# Altium project beovox-poe.PrjPcb (part 1 of 2)
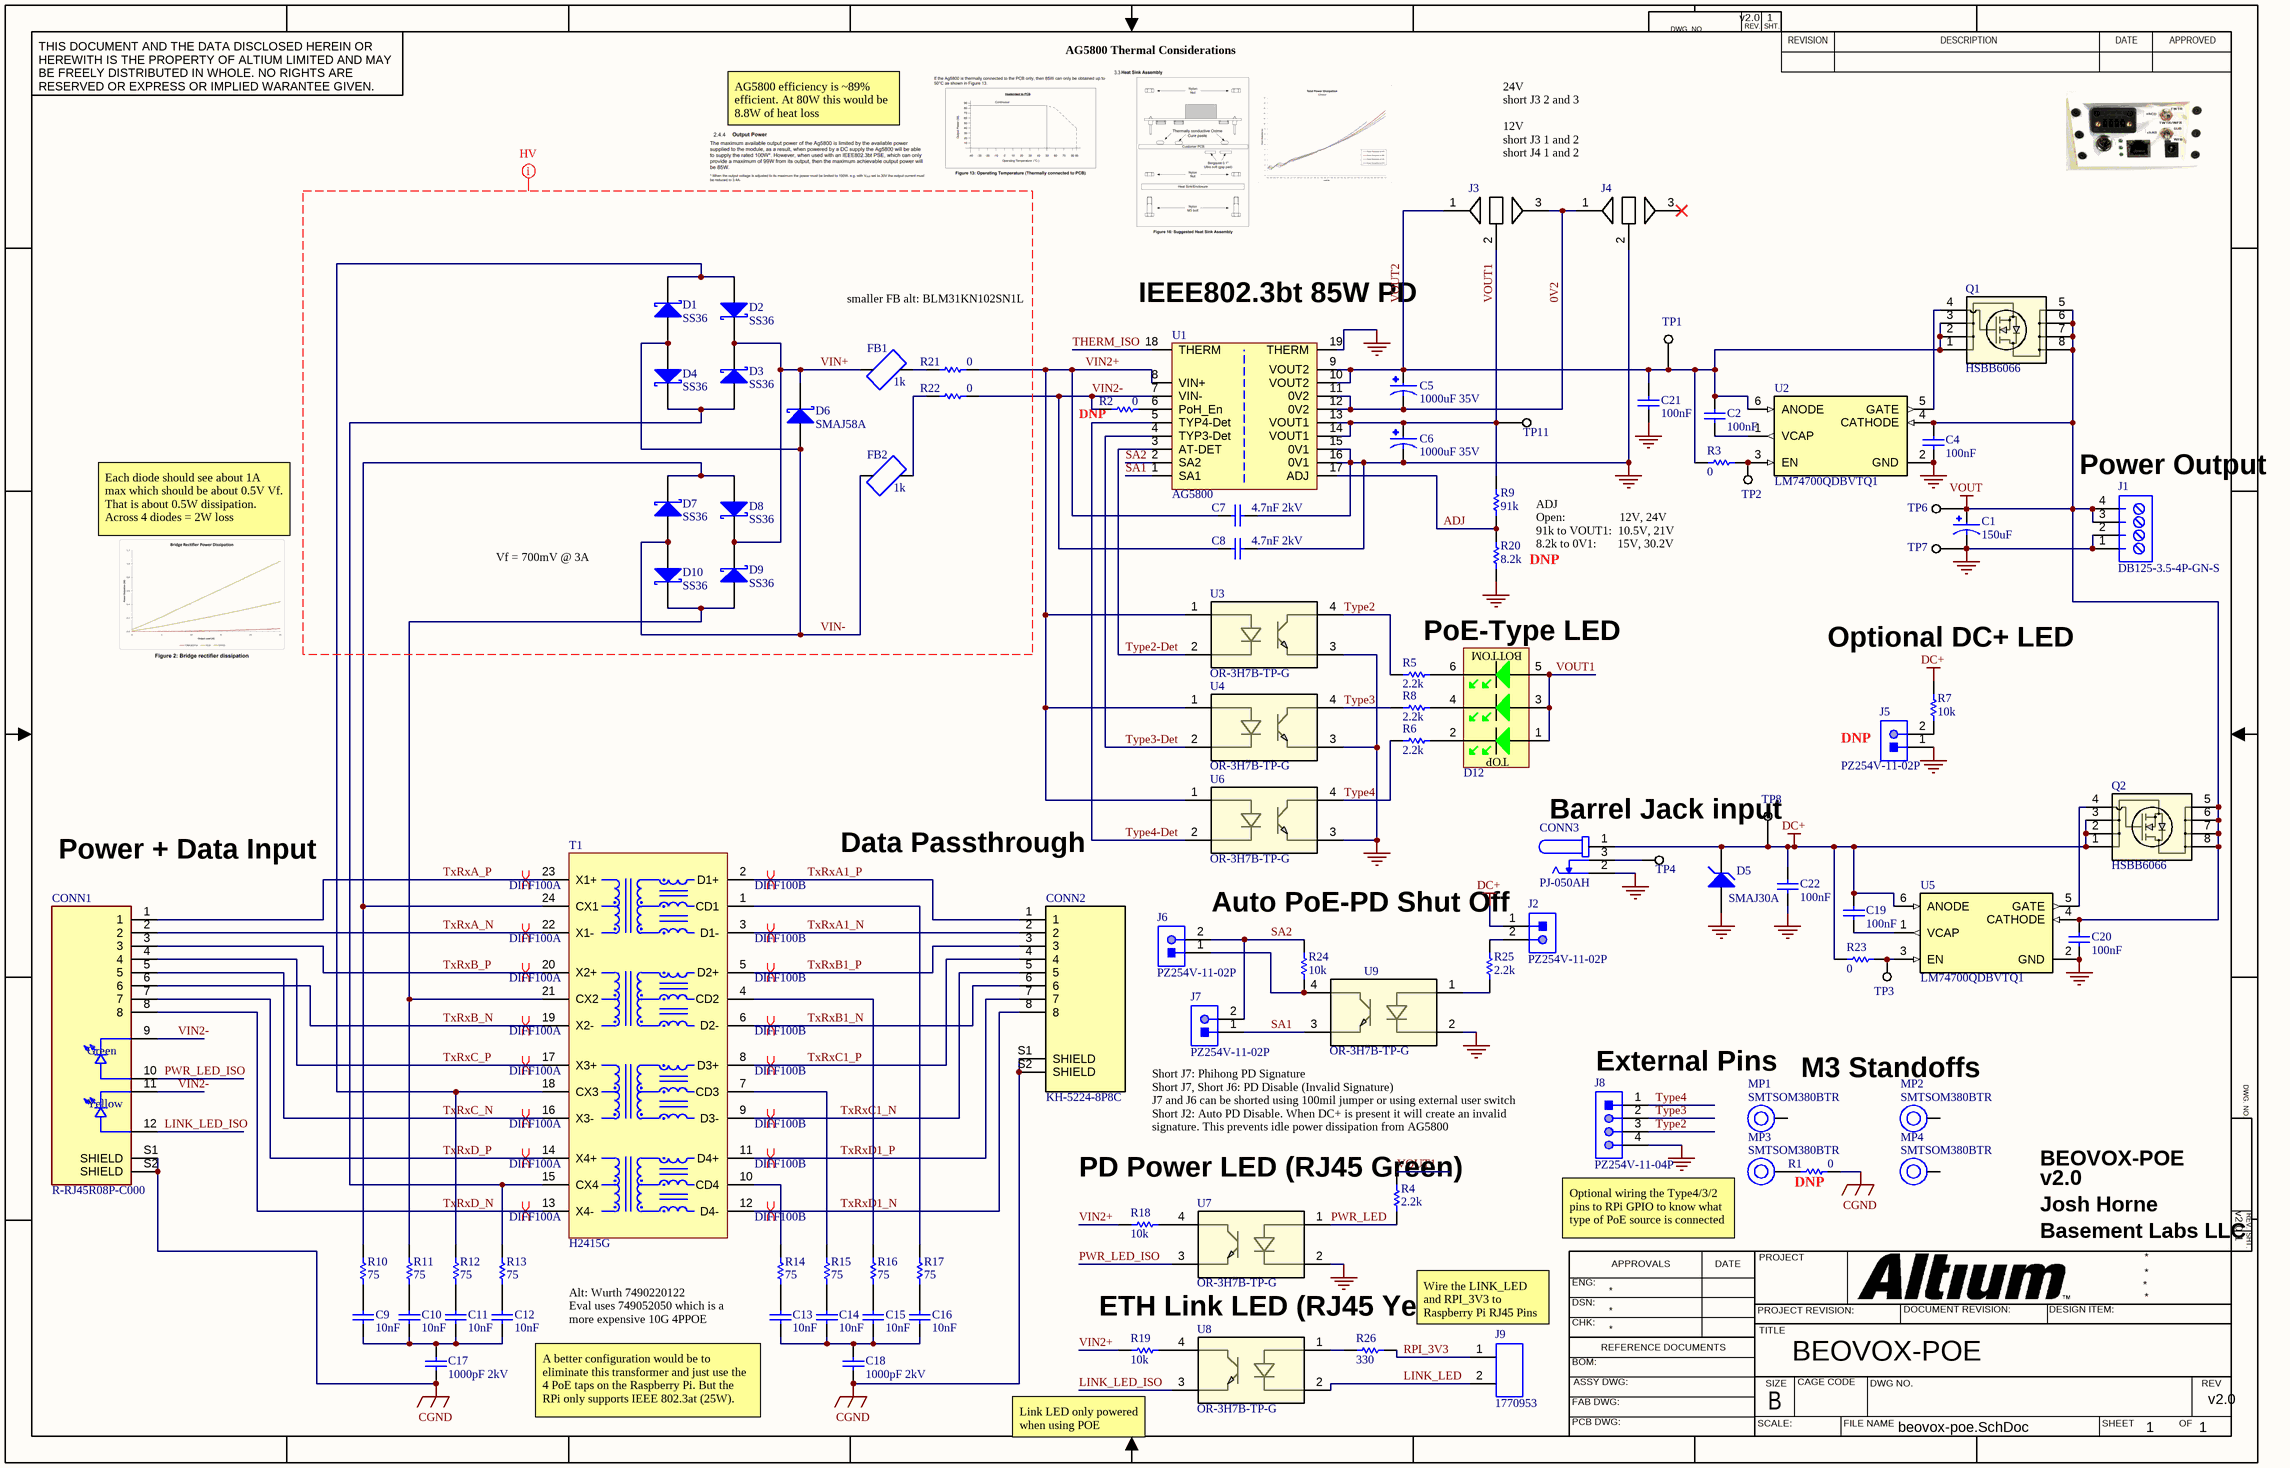
[diagram p0: beovox-poe.SchDoc]
ItemRevision: v2.0; PCB_ENGINEER: JOSH HORNE; PCB_TITLE_1: BEOVOX-POE; PCB_TITLE_2: v2.0; Revision: v2.0; Title: BEOVOX-POE
1 sheet, 96 parts. Net scope: global (net labels, ports and power ports of the same name join across sheets).
Board file: beovox-poe.PcbDoc

## Sheet beovox-poe.SchDoc: BEOVOX-POE
size 431 x 279 mm; SheetNumber: 1; SheetTotal: 1

### Parts
C1  150uF  [CAP_CAN_10D_16H_THT]
C2  100nF  [CAP_0603_SK]
C4  100nF  [CAP_0603_SK]
C5  1000uF 35V  [CAP_TH_5_10X20]
C6  1000uF 35V  [CAP_TH_5_10X20]
C7  4.7nF 2kV  [CAP_1206_SK]
C8  4.7nF 2kV  [CAP_1206_SK]
C9  10nF  [CAP_0603_SK]
C10  10nF  [CAP_0603_SK]
C11  10nF  [CAP_0603_SK]
C12  10nF  [CAP_0603_SK]
C13  10nF  [CAP_0603_SK]
C14  10nF  [CAP_0603_SK]
C15  10nF  [CAP_0603_SK]
C16  10nF  [CAP_0603_SK]
C17  1000pF 2kV  [CAP_1206_SK]
C18  1000pF 2kV  [CAP_1206_SK]
C19  100nF  [CAP_0603_SK]
C20  100nF  [CAP_0603_SK]
C21  100nF  [CAP_0603_SK]
C22  100nF  [CAP_0603_SK]
CONN1  R-RJ45R08P-C000  [R-RJ45R08P-C000]
CONN2  KH-5224-8P8C  [CONN_RJ45_KH-5224-8P8C]
CONN3  PJ-050AH  [CUI_PJ-050AH]
D1  SS36  [DIOD-SMA-2_V]
D2  SS36  [DIOD-SMA-2_V]
D3  SS36  [DIOD-SMA-2_V]
D4  SS36  [DIOD-SMA-2_V]
D5  SMAJ30A  [DIOD-B360A_V]
D6  SMAJ58A  [DIOD-SMA-2_V]
D7  SS36  [DIOD-SMA-2_V]
D8  SS36  [DIOD-SMA-2_V]
D9  SS36  [DIOD-SMA-2_V]
D10  SS36  [DIOD-SMA-2_V]
D12  3 Diode Vertical LED Green  [MHK33147CGBTD]  (value not drawn)
FB1  1k  [FB_1810]
FB2  1k  [FB_1810]
J1  DB125-3.5-4P-GN-S  [DB125-3.5-4P-GN-S]
J2  PZ254V-11-02P  [61300211121]
J3  JUMPER  [SOLDER_JUMPER_3 large]  (value not drawn)  (no BOM)
J4  JUMPER  [SOLDER_JUMPER_3 large]  (value not drawn)  (no BOM)
J5  PZ254V-11-02P  [61300211121]
J6  PZ254V-11-02P  [61300211121]
J7  PZ254V-11-02P  [61300211121]
J8  PZ254V-11-04P  [HDR_MALE_1x4]
J9  1770953  [1770953]
MP1  SMTSOM380BTR  [SMTSOM380_PlatedScrew]
MP2  SMTSOM380BTR  [SMTSOM380_PlatedScrew]
MP3  SMTSOM380BTR  [SMTSOM380_PlatedScrew]
MP4  SMTSOM380BTR  [SMTSOM380_PlatedScrew]
Q1  HSBB6066  [PPAK3X3_GAS]
Q2  HSBB6066  [PPAK3X3_GAS]
R1  0  [RES_0805]
R2  0  [RES_0603]
R3  0  [RES_0603]
R4  2.2k  [RES_0603]
R5  2.2k  [RES_0603]
R6  2.2k  [RES_0603]
R7  10k  [RES_0603]
R8  2.2k  [RES_0603]
R9  91k  [RES_0603]
R10  75  [RES_0603]
R11  75  [RES_0603]
R12  75  [RES_0603]
R13  75  [RES_0603]
R14  75  [RES_0603]
R15  75  [RES_0603]
R16  75  [RES_0603]
R17  75  [RES_0603]
R18  10k  [RES_0603]
R19  10k  [RES_0603]
R20  8.2k  [RES_0603]
R21  0  [RES_1812]
R22  0  [RES_1812]
R23  0  [RES_0603]
R24  10k  [RES_0603]
R25  2.2k  [RES_0603]
R26  330  [RES_0603]
T1  H2415G  [XFMR_H2415G]
TP1  TP  [Test_Point]  (value not drawn)  (no BOM)
TP2  TP  [Test_Point]  (value not drawn)  (no BOM)
TP3  TP  [Test_Point]  (value not drawn)  (no BOM)
TP4  TP  [Test_Point]  (value not drawn)  (no BOM)
TP6  TP  [Test_Point]  (value not drawn)  (no BOM)
TP7  TP  [Test_Point]  (value not drawn)  (no BOM)
TP8  TP  [Test_Point]  (value not drawn)  (no BOM)
TP11  TP  [Test_Point]  (value not drawn)  (no BOM)
U1  AG5800  [AG5800]
U2  LM74700QDBVTQ1  [SOT95P280X145-6N]
U3  OR-3H7B-TP-G  [SOIC_(B)(TA)-VG_EVS]
U4  OR-3H7B-TP-G  [SOIC_(B)(TA)-VG_EVS]
U5  LM74700QDBVTQ1  [SOT95P280X145-6N]
U6  OR-3H7B-TP-G  [SOIC_(B)(TA)-VG_EVS]
U7  OR-3H7B-TP-G  [SOIC_(B)(TA)-VG_EVS]
U8  OR-3H7B-TP-G  [SOIC_(B)(TA)-VG_EVS]
U9  OR-3H7B-TP-G  [SOIC_(B)(TA)-VG_EVS]

### Nets
CGND: C17.1 C18.1 CONN1.S1(SHIELD) CONN1.S2(SHIELD) CONN2.S1(SHIELD) CONN2.S2(SHIELD) R1.2
DC+: C19.2 C22.2 CONN3.1 D5.2(K) J2.1 Q2.1 Q2.2 Q2.3 R7.1 R23.2 TP8.1 U5.6(ANODE)
GND: C1.N C4.1 C6.N C7.2 C8.2 C20.1 C21.1 C22.1 CONN3.2 D5.1(A) J1.1 J1.2 J4.2 J5.1 J8.4 R20.1 TP7.1 U1.15(0V1) U1.16(0V1) U1.19(THERM) U2.2(GND) U3.3 U4.3 U5.2(GND) U6.3 U7.2 U9.2
VOUT: C1.P C4.2 C20.2 J1.3 J1.4 Q1.5 Q1.6 Q1.7 Q1.8 Q2.5 Q2.6 Q2.7 Q2.8 TP6.1 U2.4(CATHODE) U5.4(CATHODE)
0V2: C5.N J3.3 J4.1 U1.11(0V2) U1.12(0V2)
ADJ: R9.2 R20.2 U1.17(ADJ)
LINK_LED: J9.2 U8.2
LINK_LED_ISO: CONN1.12 U8.3
PWR_LED: R4.1 U7.1
PWR_LED_ISO: CONN1.10 U7.3
RPI_3V3: J9.1 R26.2
SA1: J7.1 U1.1(SA1) U9.3
SA2: J6.2 J7.2 R24.2 U1.2(SA2)
THERM_ISO: U1.18(THERM)
TxRxA1_N: CONN2.2 T1.3(D1-)
TxRxA1_P: CONN2.1 T1.2(D1+)
TxRxA_N: CONN1.2 T1.22(X1-)
TxRxA_P: CONN1.1 T1.23(X1+)
TxRxB1_N: CONN2.6 T1.6(D2-)
TxRxB1_P: CONN2.3 T1.5(D2+)
TxRxB_N: CONN1.6 T1.19(X2-)
TxRxB_P: CONN1.3 T1.20(X2+)
TxRxC1_N: CONN2.5 T1.9(D3-)
TxRxC1_P: CONN2.4 T1.8(D3+)
TxRxC_N: CONN1.5 T1.16(X3-)
TxRxC_P: CONN1.4 T1.17(X3+)
TxRxD1_N: CONN2.8 T1.12(D4-)
TxRxD1_P: CONN2.7 T1.11(D4+)
TxRxD_N: CONN1.8 T1.13(X4-)
TxRxD_P: CONN1.7 T1.14(X4+)
Type2: J8.3 R5.2 U3.4
Type2-Det: U1.3(AT-DET) U3.2
Type3: J8.2 R8.2 U4.4
Type3-Det: U1.4(TYP3-Det) U4.2
Type4: J8.1 R6.2 U6.4
Type4-Det: U1.5(TYP4-Det) U6.2
VIN2+: C7.1 R18.2 R19.2 R21.2 U1.8(VIN+) U3.1 U4.1 U6.1
VIN2-: C8.1 CONN1.9 CONN1.11 R2.2 R22.2 U1.7(VIN-)
VIN+: D2.2(K) D3.2(K) D6.2(K) D8.2(K) D9.2(K) FB1.1
VIN-: D1.1(A) D4.1(A) D6.1(A) D7.1(A) D10.1(A) FB2.1
VOUT1: C6.P D12.1 D12.3 D12.5 J3.2 R4.2 R9.1 TP11.1 U1.13(VOUT1) U1.14(VOUT1)
VOUT2: C2.2 C5.P C21.2 J3.1 Q1.1 Q1.2 Q1.3 R3.2 TP1.1 U1.9(VOUT2) U1.10(VOUT2) U2.6(ANODE)
NetC2_1: C2.1 U2.1(VCAP)
NetC9_1: C9.1 C10.1 C11.1 C12.1 C17.2
NetC9_2: C9.2 R10.1
NetC10_2: C10.2 R11.1
NetC11_2: C11.2 R12.1
NetC12_2: C12.2 R13.1
NetC13_1: C13.1 C14.1 C15.1 C16.1 C18.2
NetC13_2: C13.2 R14.1
NetC14_2: C14.2 R15.1
NetC15_2: C15.2 R16.1
NetC16_2: C16.2 R17.1
NetC19_1: C19.1 U5.1(VCAP)
NetCONN3_3: CONN3.3 TP4.1
NetD1_2: D1.2(K) D2.1(A) R12.2 T1.18(CX3)
NetD3_1: D3.1(A) D4.2(K) R13.2 T1.15(CX4)
NetD7_2: D7.2(K) D8.1(A) R10.2 T1.24(CX1)
NetD9_1: D9.1(A) D10.2(K) R11.2 T1.21(CX2)
NetD12_2: D12.2 R6.1
NetD12_4: D12.4 R8.1
NetD12_6: D12.6 R5.1
NetFB1_2: FB1.2 R21.1
NetFB2_2: FB2.2 R22.1
NetJ2_2: J2.2 R25.2
NetJ5_2: J5.2 R7.2
NetJ6_1: J6.1 R24.1 U9.4
NetMP3_1: MP3.1 R1.1
NetQ1_4: Q1.4 U2.5(GATE)
NetQ2_4: Q2.4 U5.5(GATE)
NetR2_1: R2.1 U1.6(PoH_En)
NetR3_1: R3.1 TP2.1 U2.3(EN)
NetR14_2: R14.2 T1.10(CD4)
NetR15_2: R15.2 T1.7(CD3)
NetR16_2: R16.2 T1.4(CD2)
NetR17_2: R17.2 T1.1(CD1)
NetR18_1: R18.1 U7.4
NetR19_1: R19.1 U8.4
NetR23_1: R23.1 TP3.1 U5.3(EN)
NetR25_1: R25.1 U9.1
NetR26_1: R26.1 U8.1

Not connected (* = marked no-connect by the designer): J4 3*; MP1 1; MP2 1; MP4 1

### Layout directives
net class HV: VIN+, VIN-
differential pair; differential pair class DIFF100A: TxRxA_N, TxRxA_P, TxRxB_N, TxRxB_P, TxRxC_N, TxRxC_P, TxRxD_N, TxRxD_P
differential pair; differential pair class DIFF100B: TxRxA1_N, TxRxA1_P, TxRxB1_N, TxRxB1_P, TxRxC1_N, TxRxC1_P, TxRxD1_N, TxRxD1_P

### Notes on the sheet
- AG5800 Thermal Considerations
- AG5800 efficiency is ~89% efficient. At 80W this would be 8.8W of heat loss
- 24V
  short J3 2 and 3
  12V
  short J3 1 and 2
  short J4 1 and 2
- smaller FB alt: BLM31KN102SN1L
- (near U1) IEEE802.3bt 85W PD
- (near R2) DNP
- (near J1) Power Output
- Each diode should see about 1A max which should be about 0.5V Vf. That is about 0.5W dissipation. Across 4 diodes = 2W loss
- DNP
- ADJ
  Open:                  12V, 24V
  91k to VOUT1:  10.5V, 21V
  8.2k to 0V1:       15V, 30.2V
- Vf = 700mV @ 3A
- PoE-Type LED
- (near R7) Optional DC+ LED
- (near J5) DNP
- (near TP8) Barrel Jack input
- Power + Data Input
- Data Passthrough
- Auto PoE-PD Shut Off
- External Pins
- M3 Standoffs
- Short J7: Phihong PD Signature
  Short J7, Short J6: PD Disable (Invalid Signature)
  J7 and J6 can be shorted using 100mil jumper or using external user switch
  Short J2: Auto PD Disable. When DC+ is present it will create an invalid signature. This prevents idle power dissipation from AG5800
- (near R4) PD Power LED (RJ45 Green)
- (near R1) DNP
- Josh Horne
- Optional wiring the Type4/3/2 pins to RPi GPIO to know what type of PoE source is connected
- Basement Labs LLC
- Alt: Wurth 7490220122
  Eval uses 749052050 which is a more expensive 10G 4PPOE
- ETH Link LED (RJ45 Yellow)
- Wire the LINK_LED and RPI_3V3 to Raspberry Pi RJ45 Pins
- A better configuration would be to eliminate this transformer and just use the 4 PoE taps on the Raspberry Pi. But the RPi only supports IEEE 802.3at (25W).
- Link LED only powered when using POE
- DWG. NO.
- REV.
- SHT.
- THIS DOCUMENT AND THE DATA DISCLOSED HEREIN OR HEREWITH IS THE PROPERTY OF ALTIUM LIMITED AND MAY BE FREELY DISTRIBUTED IN WHOLE. NO RIGHTS ARE RESERVED OR EXPRESS OR IMPLIED WARANTEE GIVEN.
- REVISION
- DESCRIPTION
- DATE
- APPROVED
- ENG:
- APPROVALS
- PROJECT
- DSN:
- CHK:
- REFERENCE DOCUMENTS
- PROJECT REVISION:
- TITLE
- DOCUMENT REVISION:
- DESIGN ITEM:
- BOM:
- FAB DWG:
- PCB DWG:
- ASSY DWG:
- SCALE:
- SIZE
- B
- CAGE CODE
- FILE NAME
- DWG NO.
- SHEET
- OF
- REV
- (in symbol MHK33147CGBTD) BOTTOM; TOP
- (in symbol R-RJ45R08P-C000) Green; Yellow